# EAGLE design Apex4ROBOTS_1_0 (EAGLE 9.5.2)

## Sheet 1 of 3
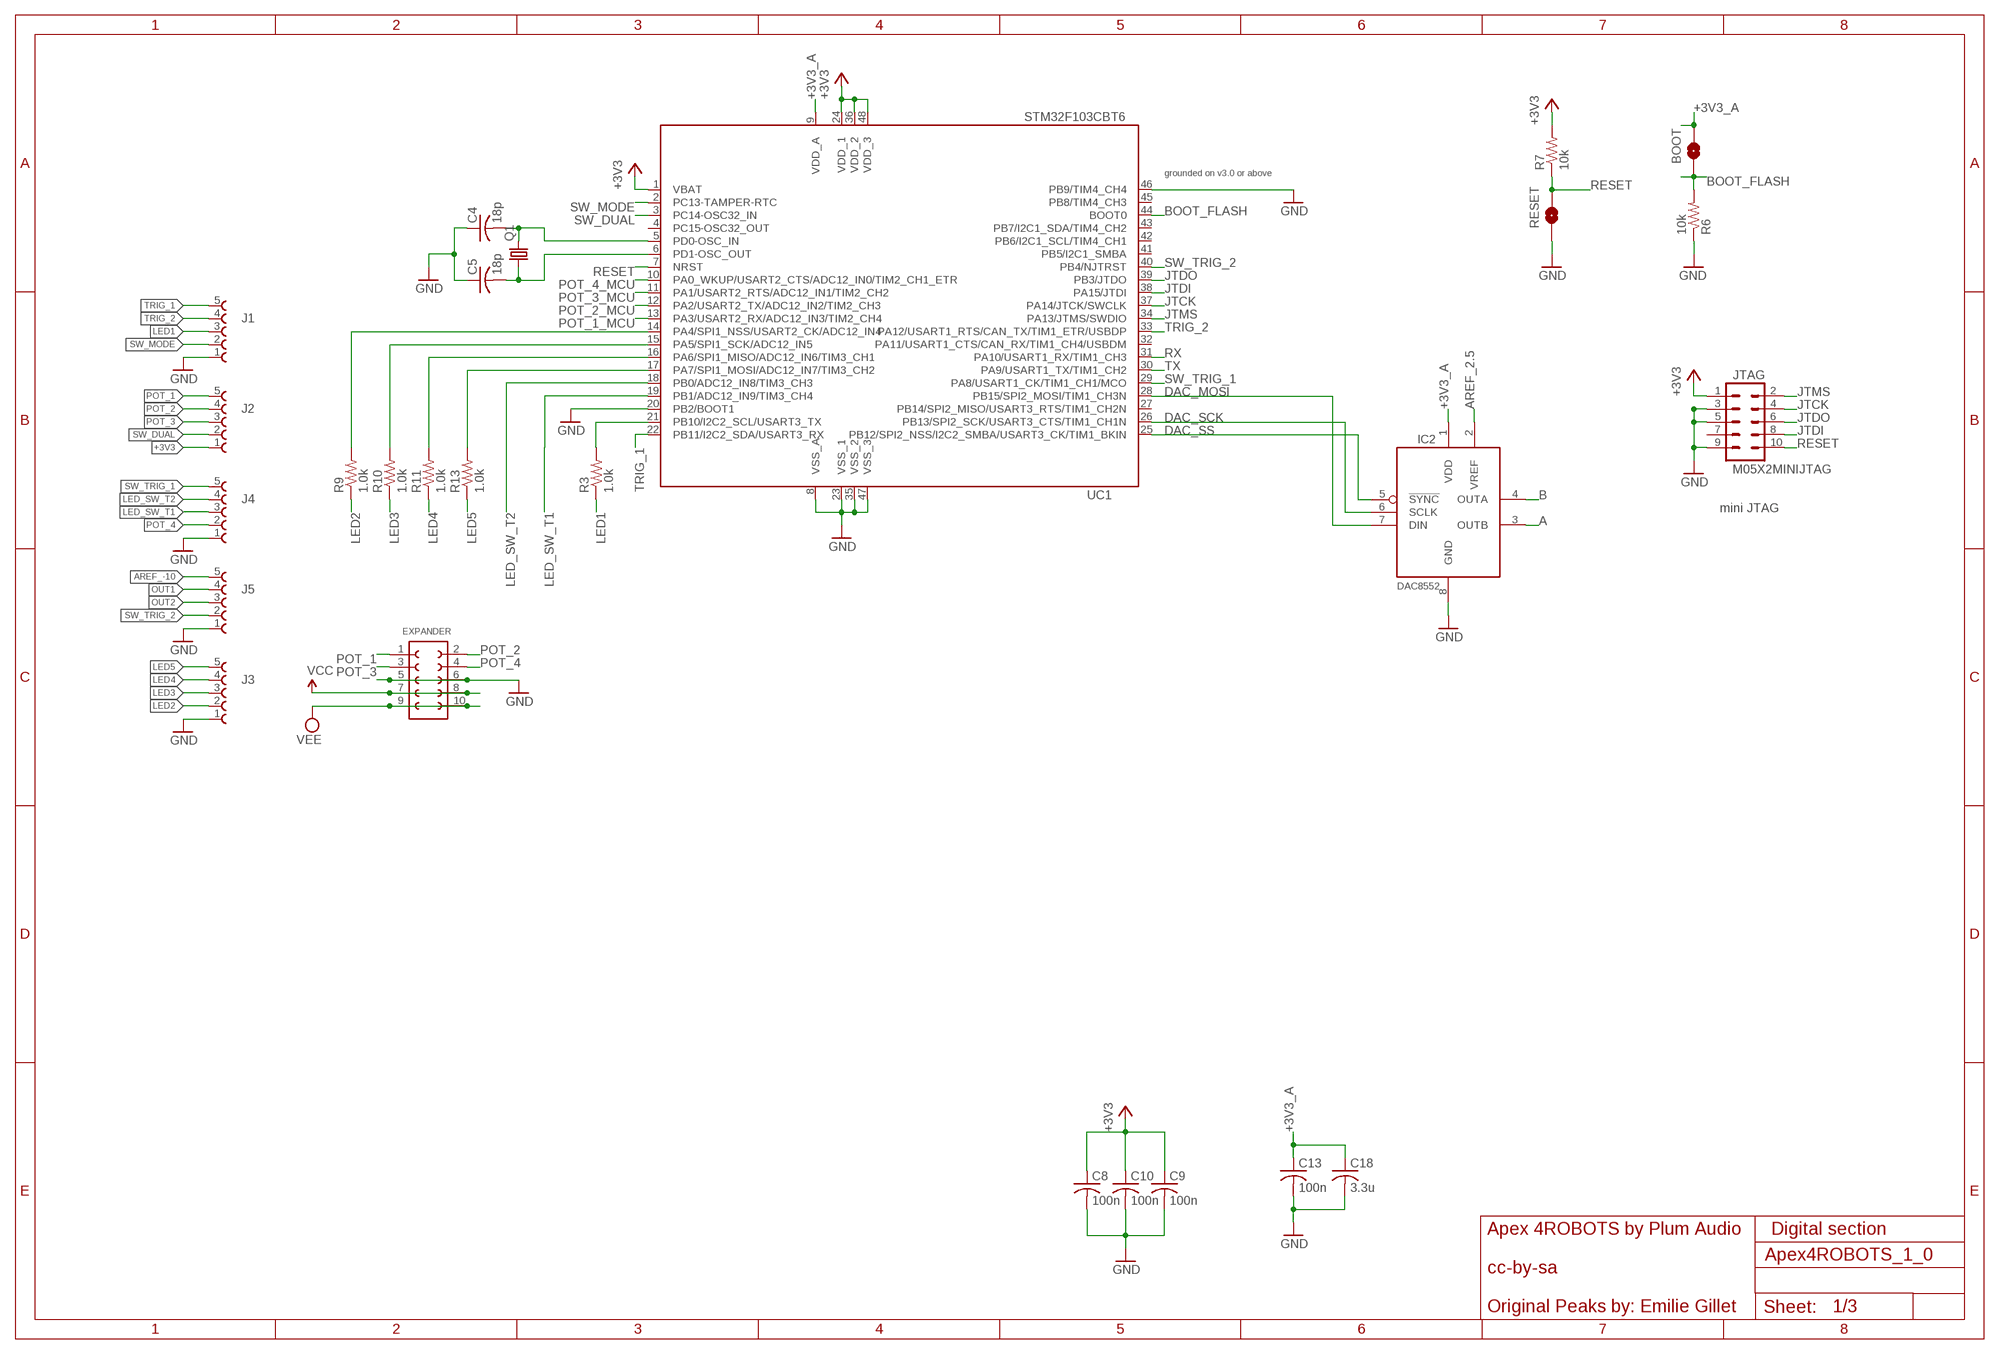
[diagram p0: schematic, sheet 1]

### Parts
BOOT  BOOT  JUMPER-SMT_2_NO_SILK  [SMT-JUMPER_2_NO_SILK]
C4  18p  C-USC0603  [C0603]
C5  18p  C-USC0603  [C0603]
C8  100n  C-USC0603  [C0603]
C9  100n  C-USC0603  [C0603]
C10  100n  C-USC0603  [C0603]
C13  100n  C-USC0603  [C0603]
C18  3.3u  C-USC0603  [C0603]
EXPANDER  61301021121  [61301021121]
IC2  DAC8552  [MSOP-8]
J1  61300511121  [61300511121]
J2  61300511121  [61300511121]
J3  61300511121  [61300511121]
J4  61300511121  [61300511121]
J5  61300511121  [61300511121]
JTAG  M05X2MINIJTAG  [2X5-1.27]
Q1  CRYSTAL7A  [XTAL500X320X120]
R3  1.0k  R-US_R0603  [R0603]
R6  10k  R-US_R0603  [R0603]
R7  10k  R-US_R0603  [R0603]
R9  1.0k  R-US_R0603  [R0603]
R10  1.0k  R-US_R0603  [R0603]
R11  1.0k  R-US_R0603  [R0603]
R13  1.0k  R-US_R0603  [R0603]
RESET  RESET  JUMPER-SMT_2_NO_SILK  [SMT-JUMPER_2_NO_SILK]
UC1  STM32F103CBT6  STM32F103CB  [LQFP48]

### Nets
+3V3: C8.1 C9.1 C10.1 J2.1 JTAG.1 R7.2 UC1.1(VBAT) UC1.24(VDD_1) UC1.36(VDD_2) UC1.48(VDD_3) ; also sheet 3
+3V3_A: BOOT.2 C13.1 C18.1 IC2.1(VDD) UC1.9(VDD_A) ; also sheet 2,3
A: IC2.3(OUTB) ; also sheet 2
AREF_2.5: IC2.2(VREF) ; also sheet 3
AREF_-10: J5.5 ; also sheet 2,3
B: IC2.4(OUTA) ; also sheet 2
BOOT_FLASH: BOOT.1 R6.2 UC1.44(BOOT0)
DAC_MOSI: IC2.7(DIN) UC1.28(PB15/SPI2_MOSI/TIM1_CH3N)
DAC_SCK: IC2.6(SCLK) UC1.26(PB13/SPI2_SCK/USART3_CTS/TIM1_CH1N)
DAC_SS: IC2.5(!SYNC) UC1.25(PB12/SPI2_NSS/I2C2_SMBA/USART3_CK/TIM1_BKIN)
GND: C4.1 C5.1 C8.2 C9.2 C10.2 C13.2 C18.2 EXPANDER.5 EXPANDER.6 IC2.8(GND) J1.1 J3.1 J4.1 J5.1 JTAG.3 JTAG.5 JTAG.9 R6.1 RESET.1 UC1.8(VSS_A) UC1.20(PB2/BOOT1) UC1.23(VSS_1) UC1.35(VSS_2) UC1.46(PB9/TIM4_CH4) UC1.47(VSS_3) ; also sheet 2,3
JTCK: JTAG.4 UC1.37(PA14/JTCK/SWCLK)
JTDI: JTAG.8 UC1.38(PA15/JTDI)
JTDO: JTAG.6 UC1.39(PB3/JTDO)
JTMS: JTAG.2 UC1.34(PA13/JTMS/SWDIO)
LED1: J1.3 R3.1
LED2: J3.2 R9.1
LED3: J3.3 R10.1
LED4: J3.4 R11.1
LED5: J3.5 R13.1
LED_SW_T1: J4.3 UC1.19(PB1/ADC12_IN9/TIM3_CH4)
LED_SW_T2: J4.4 UC1.18(PB0/ADC12_IN8/TIM3_CH3)
N$7: C4.2 Q1.2 UC1.5(PD0-OSC_IN)
N$8: C5.2 Q1.1 UC1.6(PD1-OSC_OUT)
N$10: R9.2 UC1.14(PA4/SPI1_NSS/USART2_CK/ADC12_IN4)
N$11: R10.2 UC1.15(PA5/SPI1_SCK/ADC12_IN5)
N$12: R11.2 UC1.16(PA6/SPI1_MISO/ADC12_IN6/TIM3_CH1)
N$13: R13.2 UC1.17(PA7/SPI1_MOSI/ADC12_IN7/TIM3_CH2)
N$19: R3.2 UC1.21(PB10/I2C2_SCL/USART3_TX)
OUT1: J5.4 ; also sheet 2
OUT2: J5.3 ; also sheet 2
POT_1: EXPANDER.1 J2.5 ; also sheet 2
POT_1_MCU: UC1.13(PA3/USART2_RX/ADC12_IN3/TIM2_CH4) ; also sheet 2
POT_2: EXPANDER.2 J2.4 ; also sheet 2
POT_2_MCU: UC1.12(PA2/USART2_TX/ADC12_IN2/TIM2_CH3) ; also sheet 2
POT_3: EXPANDER.3 J2.3 ; also sheet 2
POT_3_MCU: UC1.11(PA1/USART2_RTS/ADC12_IN1/TIM2_CH2) ; also sheet 2
POT_4: EXPANDER.4 J4.2 ; also sheet 2
POT_4_MCU: UC1.10(PA0_WKUP/USART2_CTS/ADC12_IN0/TIM2_CH1_ETR) ; also sheet 2
RESET: JTAG.10 R7.1 RESET.2 UC1.7(NRST)
RX: UC1.31(PA10/USART1_RX/TIM1_CH3)
SW_DUAL: J2.2 UC1.3(PC14-OSC32_IN)
SW_MODE: J1.2 UC1.2(PC13-TAMPER-RTC)
SW_TRIG_1: J4.5 UC1.29(PA8/USART1_CK/TIM1_CH1/MCO)
SW_TRIG_2: J5.2 UC1.40(PB4/NJTRST)
TRIG_1: J1.5 UC1.22(PB11/I2C2_SDA/USART3_RX)
TRIG_2: J1.4 UC1.33(PA12/USART1_RTS/CAN_TX/TIM1_ETR/USBDP)
TX: UC1.30(PA9/USART1_TX/TIM1_CH2)
VCC: EXPANDER.7 EXPANDER.8 ; also sheet 2,3
VEE: EXPANDER.9 EXPANDER.10 ; also sheet 2,3
Unconnected: JTAG.7 UC1.4(PC15-OSC32_OUT) UC1.27(PB14/SPI2_MISO/USART3_RTS/TIM1_CH2N) UC1.32(PA11/USART1_CTS/CAN_RX/TIM1_CH4/USBDM) UC1.41(PB5/I2C1_SMBA) UC1.42(PB6/I2C1_SCL/TIM4_CH1) UC1.43(PB7/I2C1_SDA/TIM4_CH2) UC1.45(PB8/TIM4_CH3)

### Notes on the sheet
- grounded on v3.0 or above
- mini JTAG
- Apex 4ROBOTS by Plum Audio | Digital section
- cc-by-sa
- Original Peaks by: Emilie Gillet

## Sheet 2 of 3
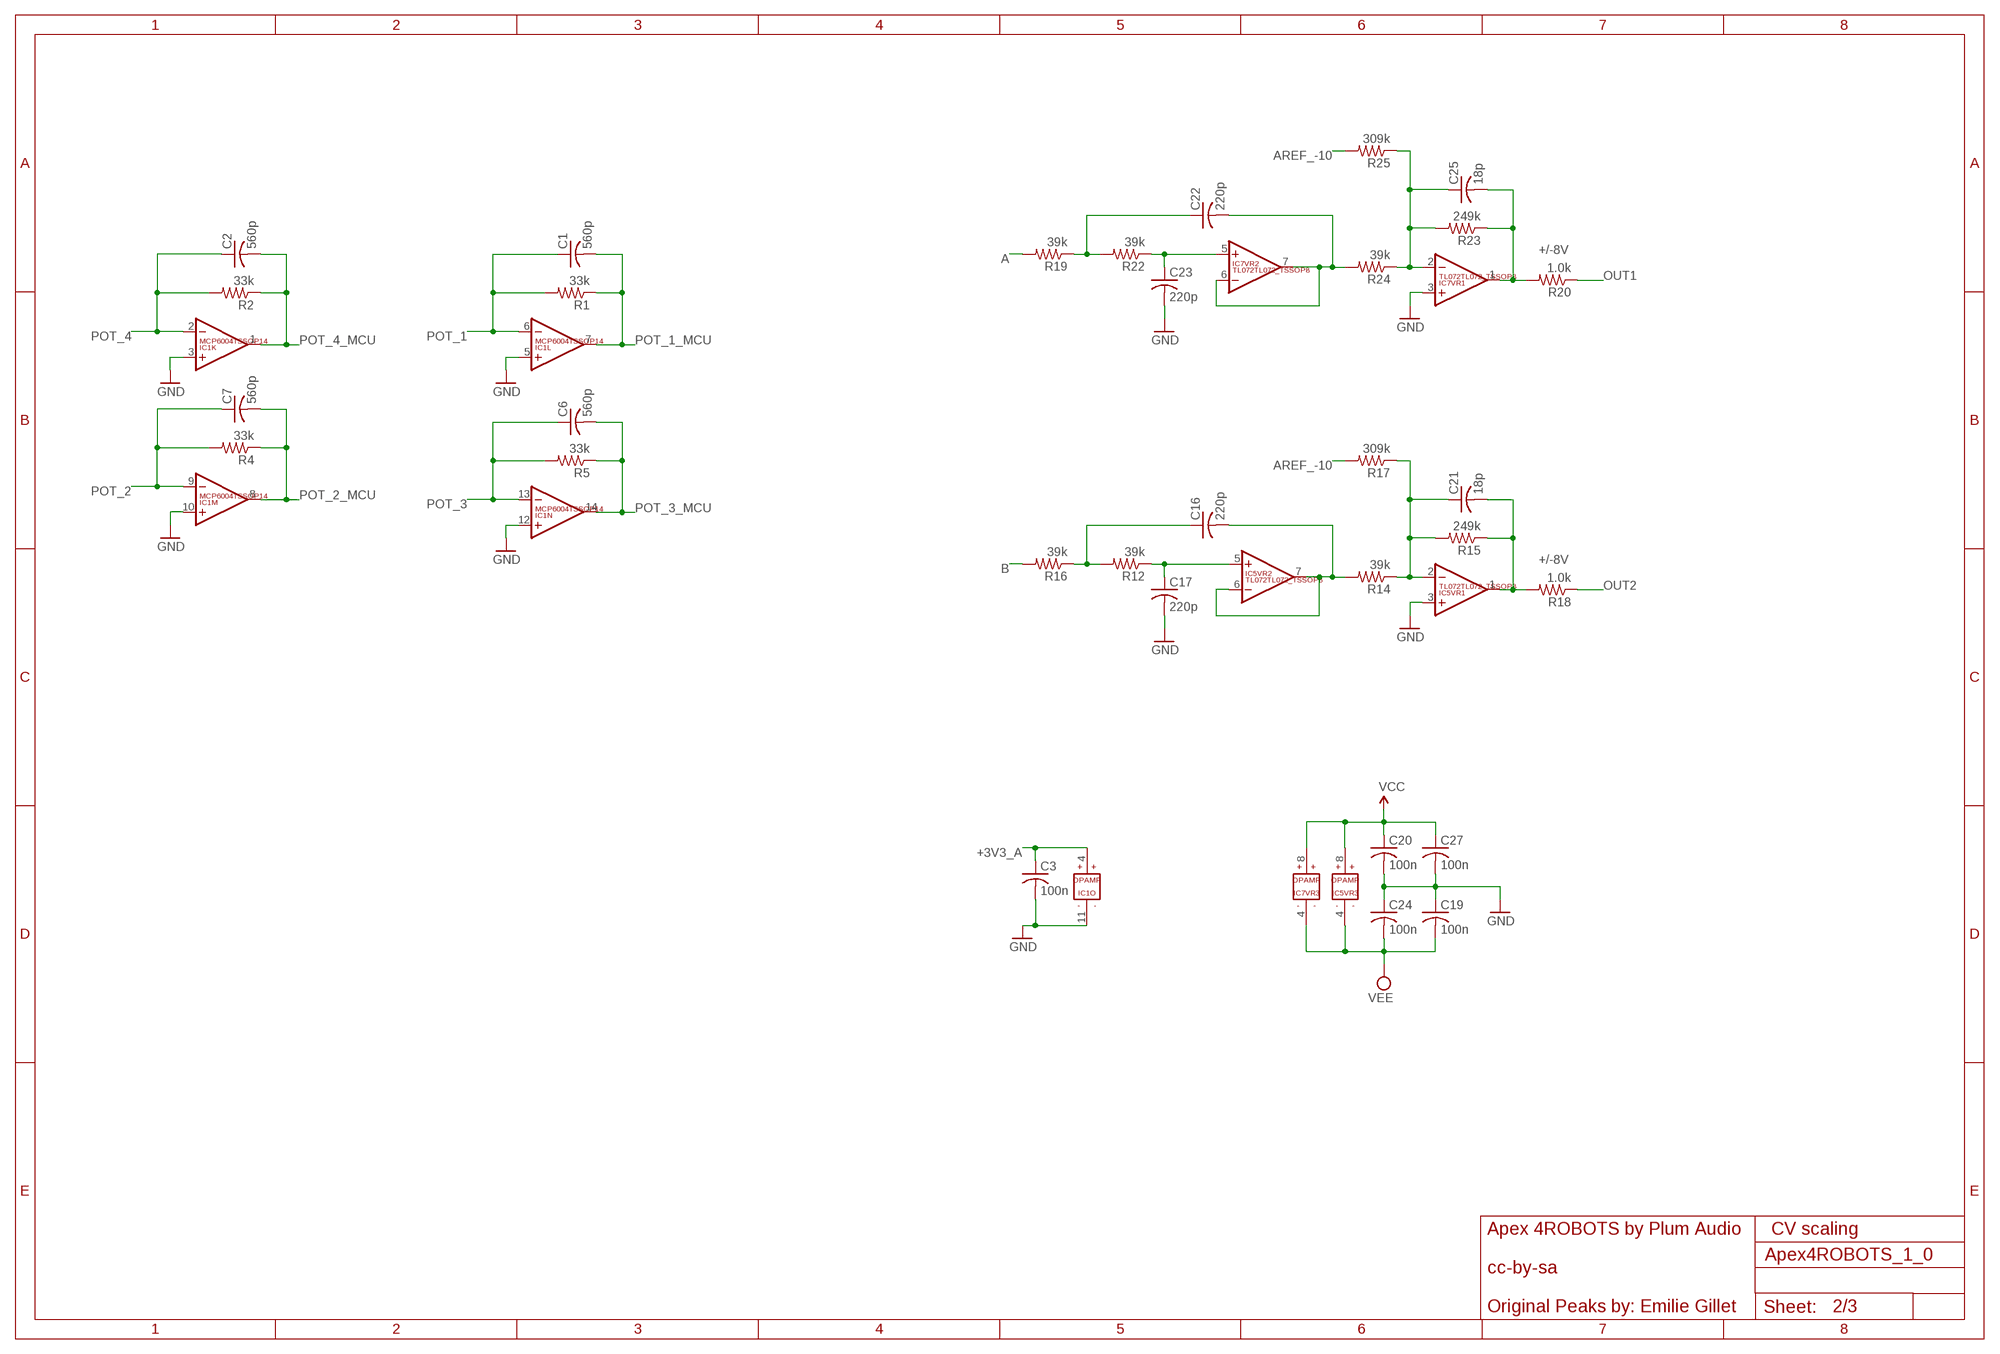
[diagram p1: schematic, sheet 2]

### Parts
C1  560p  C-USC0603  [C0603]
C2  560p  C-USC0603  [C0603]
C3  100n  C-USC0603  [C0603]
C6  560p  C-USC0603  [C0603]
C7  560p  C-USC0603  [C0603]
C16  220p  C-USC0603  [C0603]
C17  220p  C-USC0603  [C0603]
C19  100n  C-USC0603  [C0603]
C20  100n  C-USC0603  [C0603]
C21  18p  C-USC0603  [C0603]
C22  220p  C-USC0603  [C0603]
C23  220p  C-USC0603  [C0603]
C24  100n  C-USC0603  [C0603]
C25  18p  C-USC0603  [C0603]
C27  100n  C-USC0603  [C0603]
IC1  MCP6004TSSOP14  [TSSOP14]
IC5  TL072TL072_TSSOP8  [TL072_TSSOP8]
IC7  TL072TL072_TSSOP8  [TL072_TSSOP8]
R1  33k  R-US_R0603  [R0603]
R2  33k  R-US_R0603  [R0603]
R4  33k  R-US_R0603  [R0603]
R5  33k  R-US_R0603  [R0603]
R12  39k  R-US_R0603  [R0603]
R14  39k  R-US_R0603  [R0603]
R15  249k  R-US_R0603  [R0603]
R16  39k  R-US_R0603  [R0603]
R17  309k  R-US_R0603  [R0603]
R18  1.0k  R-US_R0603  [R0603]
R19  39k  R-US_R0603  [R0603]
R20  1.0k  R-US_R0603  [R0603]
R22  39k  R-US_R0603  [R0603]
R23  249k  R-US_R0603  [R0603]
R24  39k  R-US_R0603  [R0603]
R25  309k  R-US_R0603  [R0603]

### Nets
+3V3_A: C3.1 IC1.4(O:V+) ; also sheet 1,3
A: R19.2 ; also sheet 1
AREF_-10: R17.2 R25.2 ; also sheet 1,3
B: R16.2 ; also sheet 1
BI_OUT: C21.2 IC5.1(VR1:OUT) R15.1 R18.2
BI_OUT1: C25.2 IC7.1(VR1:OUT) R20.2 R23.1
F_CV: C21.1 IC5.2(VR1:-IN) R14.1 R15.2 R17.1
F_CV1: C25.1 IC7.2(VR1:-IN) R23.2 R24.1 R25.1
GND: C3.2 C17.2 C19.1 C20.2 C23.2 C24.1 C27.2 IC1.3(K:+IN) IC1.5(L:+IN) IC1.10(M:+IN) IC1.11(O:V-) IC1.12(N:+IN) IC5.3(VR1:+IN) IC7.3(VR1:+IN) ; also sheet 1,3
N$15: C22.2 IC7.6(VR2:-IN) IC7.7(VR2:OUT) R24.2
N$20: C23.1 IC7.5(VR2:+IN) R22.1
N$21: C22.1 R19.1 R22.2
N$42: C16.2 IC5.6(VR2:-IN) IC5.7(VR2:OUT) R14.2
N$43: C17.1 IC5.5(VR2:+IN) R12.1
N$45: C16.1 R12.2 R16.1
OUT1: R20.1 ; also sheet 1
OUT2: R18.1 ; also sheet 1
POT_1: C1.1 IC1.6(L:-IN) R1.2 ; also sheet 1
POT_1_MCU: C1.2 IC1.7(L:OUT) R1.1 ; also sheet 1
POT_2: C7.1 IC1.9(M:-IN) R4.2 ; also sheet 1
POT_2_MCU: C7.2 IC1.8(M:OUT) R4.1 ; also sheet 1
POT_3: C6.1 IC1.13(N:-IN) R5.2 ; also sheet 1
POT_3_MCU: C6.2 IC1.14(N:OUT) R5.1 ; also sheet 1
POT_4: C2.1 IC1.2(K:-IN) R2.2 ; also sheet 1
POT_4_MCU: C2.2 IC1.1(K:OUT) R2.1 ; also sheet 1
VCC: C20.1 C27.1 IC5.8(VR3:V+) IC7.8(VR3:V+) ; also sheet 1,3
VEE: C19.2 C24.2 IC5.4(VR3:V-) IC7.4(VR3:V-) ; also sheet 1,3

### Notes on the sheet
- +/-8V
- +/-8V
- Apex 4ROBOTS by Plum Audio | CV scaling
- cc-by-sa
- Original Peaks by: Emilie Gillet

## Sheet 3 of 3
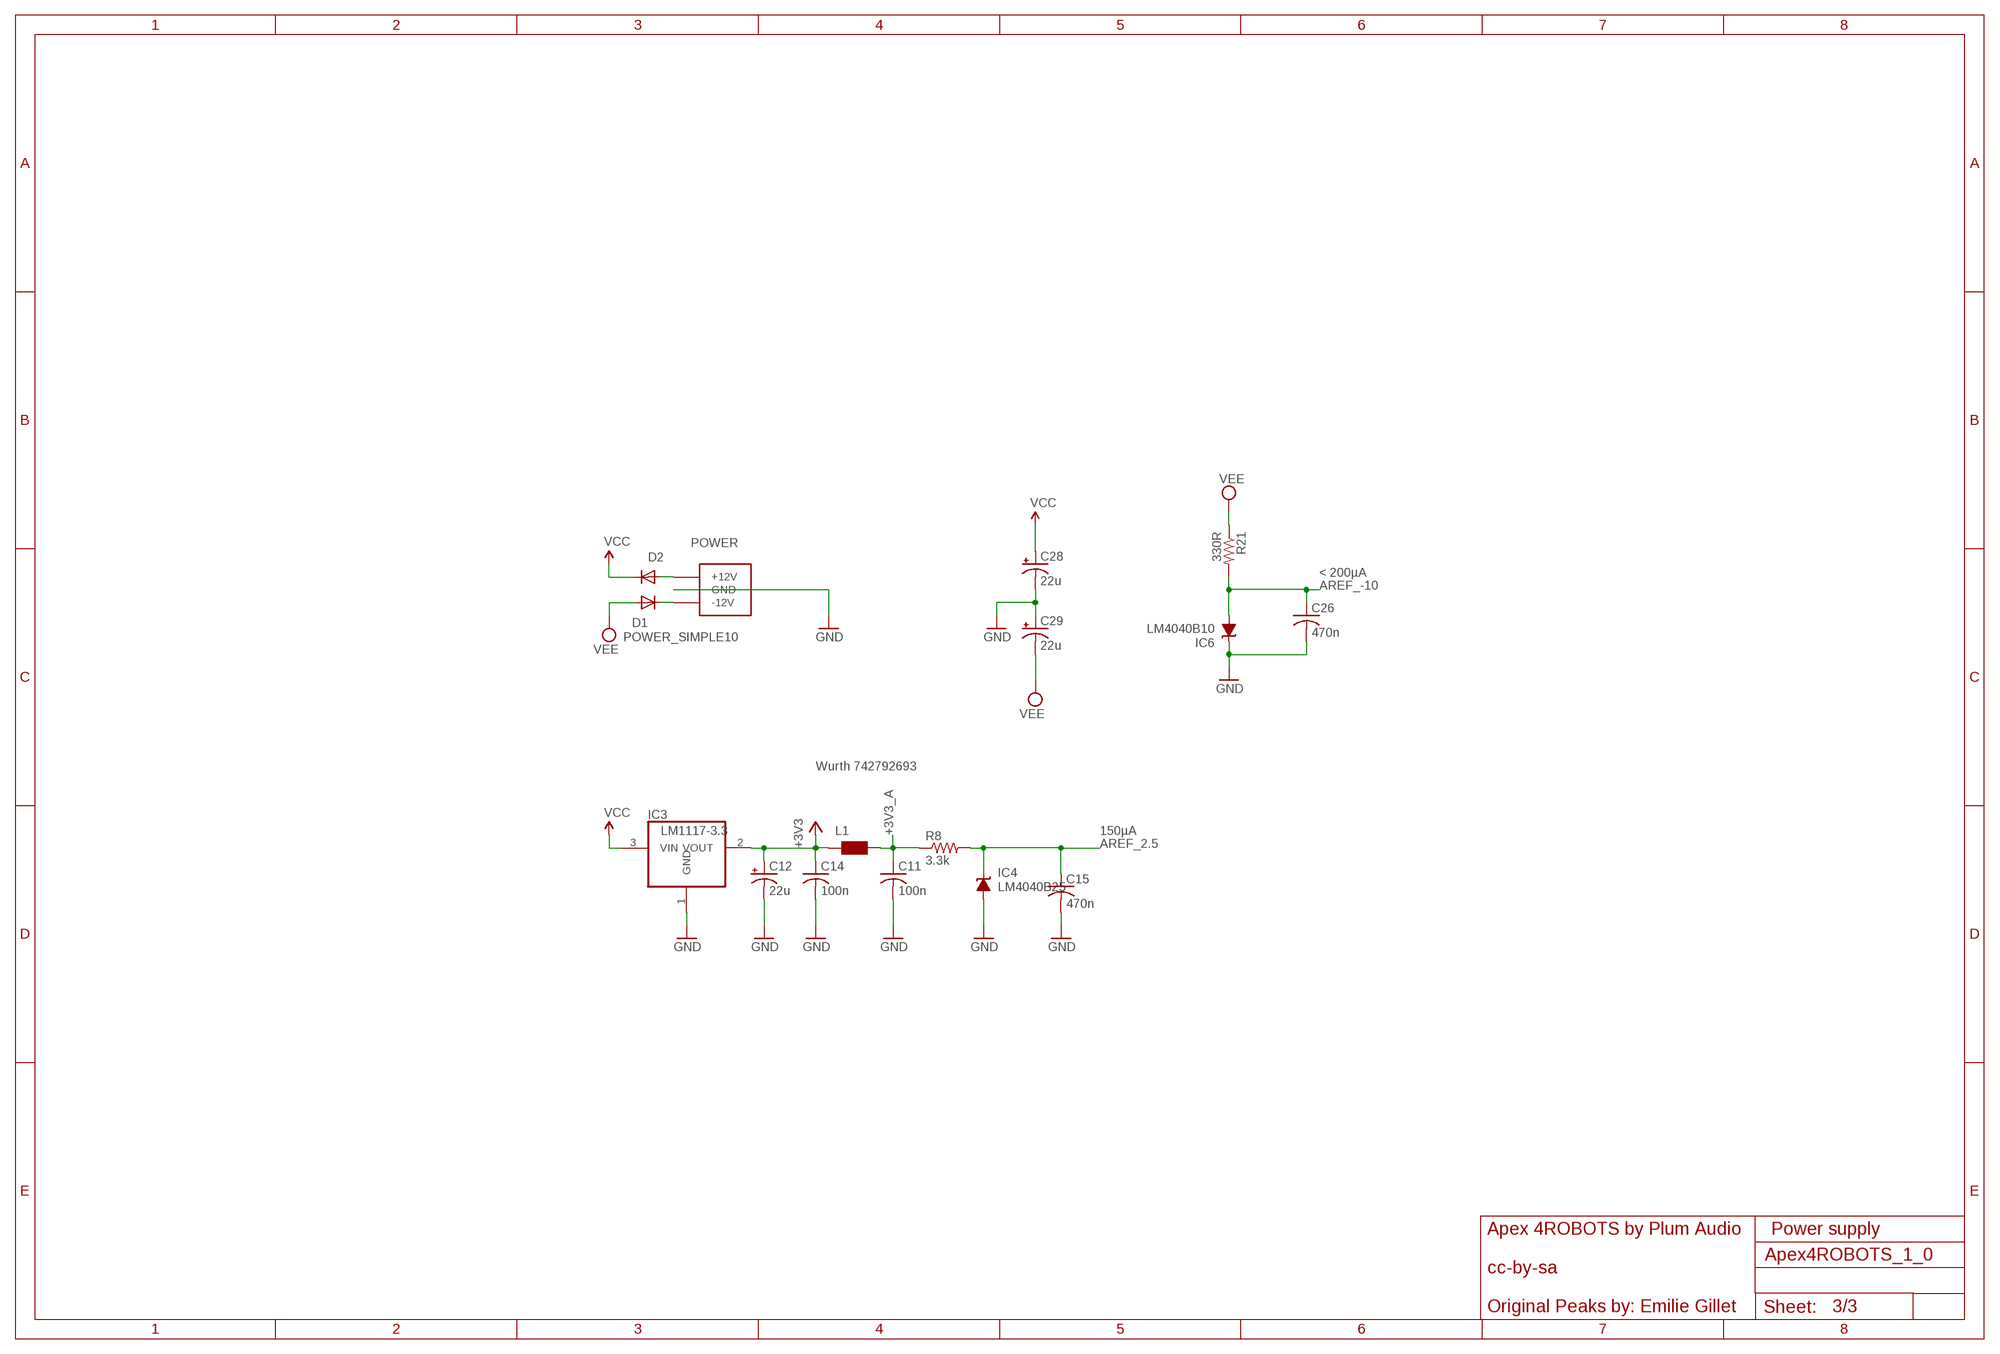
[diagram p2: schematic, sheet 3]

### Parts
C11  100n  C-USC0603  [C0603]
C12  22u  CPOL-USC  [PANASONIC_C]
C14  100n  C-USC0603  [C0603]
C15  470n  C-USC0603  [C0603]
C26  470n  C-USC0603  [C0603]
C28  22u  CPOL-USC  [PANASONIC_C]
C29  22u  CPOL-USC  [PANASONIC_C]
D1  1N5819HW  DIODE-SOD123  [SOD123]
D2  1N5819HW  DIODE-SOD123  [SOD123]
IC3  LM1117-3.3  REG1117  [SOT223]
IC4  LM4040B25  LM4041B12DBZ  [DBZ_R-PDSO-G3]
IC6  LM4040B10  LM4041B12DBZ  [DBZ_R-PDSO-G3]
L1  WE-CBF_0603  [0603]
POWER  POWER_SIMPLE10  [POWER_10]
R8  3.3k  R-US_R0603  [R0603]
R21  330R  R-US_R0603  [R0603]

### Nets
+3V3: C12.+ C14.1 IC3.2(VOUT) L1.1 ; also sheet 1
+3V3_A: C11.1 L1.2 R8.1 ; also sheet 1,2
AREF_2.5: C15.1 IC4.1(C) R8.2 ; also sheet 1
AREF_-10: C26.1 IC6.2(A) R21.2 ; also sheet 1,2
GND: C11.2 C12.- C14.2 C15.2 C26.2 C28.- C29.+ IC3.1(GND) IC4.2(A) IC6.1(C) POWER.3(GND) POWER.4(GND) POWER.5(GND) POWER.6(GND) POWER.7(GND) POWER.8(GND) ; also sheet 1,2
N$23: D2.A POWER.9(+12V) POWER.10(+12V)
N$25: D1.C POWER.1(-12V) POWER.2(-12V)
VCC: C28.+ D2.C IC3.3(VIN) ; also sheet 1,2
VEE: C29.- D1.A R21.1 ; also sheet 1,2

### Notes on the sheet
- < 200µA
- Wurth 742792693
- 150µA
- Apex 4ROBOTS by Plum Audio | Power supply
- cc-by-sa
- Original Peaks by: Emilie Gillet

## Library data of the parts
BOOT RESET = SparkFun-Jumpers:JUMPER-SMT_2_NO: Normally open jumper This jumper has two pads in close proximity to each other. Apply solder to close the connection. Round pads are easier to solder for beginners, but are a lot larger. SparkFun Product that uses the round pads: SparkFun EL Sequencer <https://www.sparkfun.com/products/12781>
C1-C11 C13-C27 = rcl:C-US: CAPACITOR, American symbol
C12 C28 C29 = rcl:CPOL-US: POLARIZED CAPACITOR, American symbol
D1 D2 = diode:DIODE-: DIODE
EXPANDER = Wurth_Elektronik_Electromechanic_Board_to_Board_Connectors_rev18b:61301021121: WR-PHD 2.54mm Dual Pin Header, 10 Pins =>Code : Con_BTB_PHD_2.54_2_61301021121 <http://katalog.we-online.de/media/images/eican/Con_BTB_PHD_2.54_2_6130xx21121_pf2.jpg> Details see: http://katalog.we-online.de/en/em/613_0xx_211_21 Created 2014-05-29, Karrer Zheng 2014 (C) Würth Elektronik
IC1 = EurorackModularParts:MCP6004
IC2 = og-dac:DAC8552
IC3 = og-vreg:REG1117: 800mA and 1A Low Dropout (LDO) Positive Regulator 1.8V, 2.5V, 2.85V, 3.3V, 5V, and Adj
IC4 IC6 = texas:LM4041: PRECISION MICROPOWER SHUNT VOLTAGE REFERENCE Source: http://focus.ti.com/lit/ds/slcs146e/slcs146e.pdf
IC5 IC7 = EurorackModularParts:TL072
J1-J5 = Wurth_Elektronik_Electromechanic_Board_to_Board_Connectors_rev17a:61300511121: WR-PHD 2.54mm Pin Header, 5 Pin =>Code : Con_BTB_PHD_2.54_1_THT_61300511121 <http://katalog.we-online.de/media/images/eican/Con_BTB_PHD_2.54_1_THT_6130xx11121_pf2.jpg> Details see: http://katalog.we-online.de/en/em/613_0xx_111_21 Created 2014-05-29, Karrer Zheng 2014 (C) Würth Elektronik
JTAG = og-header:M05X2: Header 5x2 Standard 10-pin dual row 0.1" header. Commonly used with AVR-ISP. Use with Spark Fun Electronics SKU: PRT-00778
L1 = wuerth-elektronik:WE-CBF: SMD EMI Suppression Ferrite Beads - excellent anti-EMI properties - low DCR - impedances till 3000 ohms - rated current up to 6 A
POWER = EurorackModularParts:POWER_SIMPLE
Q1 = crystal:CRYSTAL: CRYSTAL
R1-R25 = rcl:R-US_: RESISTOR, American symbol
UC1 = stm32:STM32F103CB

## Board
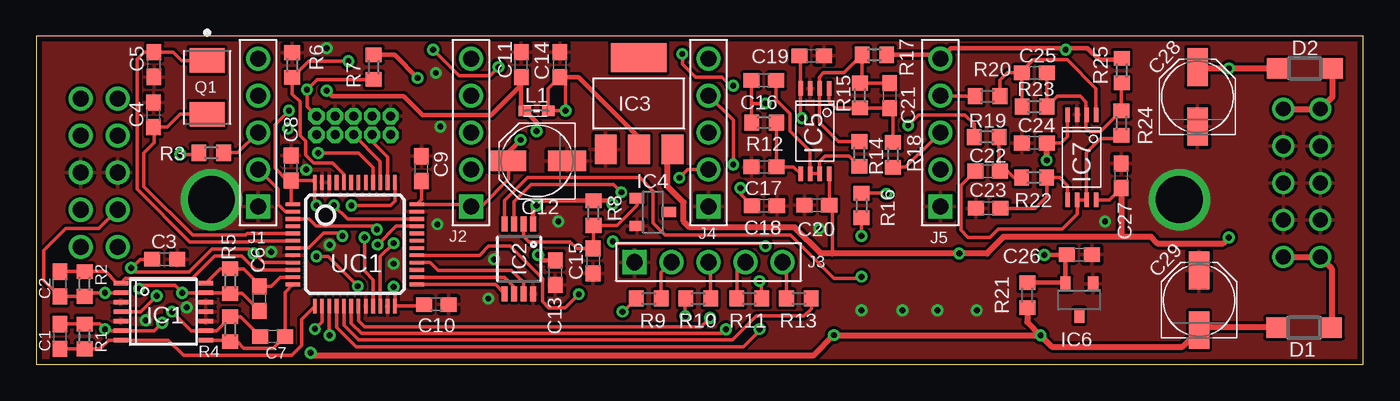
[diagram p3: board, top side]
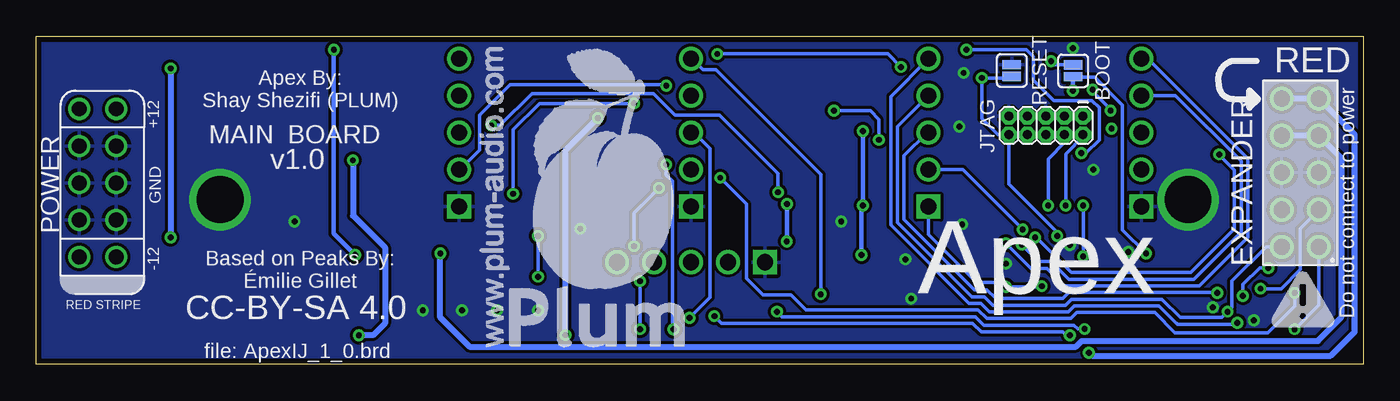
[diagram p4: board, bottom side, seen from below]

Size 91 x 22.5 mm. Coordinates in mm from the lower left corner, seen from the top.
Outline: 0,0 91,0 91,22.5 0,22.5 0,0
Copper layers (1*16): Top 0.035mm / dielectric 1.5mm / Bottom 0.035mm
Design rules "default *": minimum track width 8mil, minimum drill 0.4mm, track to track 8mil, track to pad 6mil, pad to pad 6mil, via to via 6mil, smd to smd 6mil, copper to edge 15mil, drill to drill 6mil, minimum pad ring 10mil, minimum via ring 8mil, stop-mask expansion 4mil, vias tented up to drill 20mil, thermal gap 10mil

### Footprints (pad centres in the part's own frame; a part is rotated, then mirrored left to right if it is on the bottom)
SMT-JUMPER_2_NO_SILK = smd 0.635 x 1.27: 1 -0.406,0; 2 0.406,0
C0603 = smd 1.1 x 1: 1 -0.85,0; 2 0.85,0
PANASONIC_C = smd 2.6 x 1.4: + 2.05,0; - -2.05,0
SOD123 = smd 1.4 x 1.4: A 1.9,0; C -1.9,0
61301021121 = drill 1.1: 1 -5.08,-1.27; 2 -5.08,1.27; 3 -2.54,-1.27; 4 -2.54,1.27; 5 0,-1.27; 6 0,1.27; 7 2.54,-1.27; 8 2.54,1.27; 9 5.08,-1.27; 10 5.08,1.27
TSSOP14 = smd 0.305 x 0.991: 1 -1.95,-2.918; 2 -1.3,-2.918; 3 -0.65,-2.918; 4 0,-2.918; 5 0.65,-2.918; 6 1.3,-2.918; 7 1.95,-2.918; 8 1.95,2.918; 9 1.3,2.918; 10 0.65,2.918; 11 0,2.918; 12 -0.65,2.918; 13 -1.3,2.918; 14 -1.95,2.918
MSOP-8 = smd 0.41 x 1.02: 1 -0.975,-2.4; 2 -0.325,-2.4; 3 0.325,-2.4; 4 0.975,-2.4; 5 0.975,2.4; 6 0.325,2.4; 7 -0.325,2.4; 8 -0.975,2.4
SOT223 = smd 1.499 x 2.007: 1 -2.261,-3.15; 2 0.025,-3.15; 3 2.311,-3.15 | smd 3.81 x 2.007: 4 0,3.15
DBZ_R-PDSO-G3 = smd 0.7 x 1: 1 -0.95,-1.1; 2 0.95,-1.1; 3 0,1.1
TL072_TSSOP8 = smd 0.305 x 0.991: 1 -0.975,-2.918; 2 -0.325,-2.918; 3 0.325,-2.918; 4 0.975,-2.918; 5 0.975,2.918; 6 0.325,2.918; 7 -0.325,2.918; 8 -0.975,2.918
61300511121 = drill 1.1 square: 1 -5.08,0 | drill 1.1: 2 -2.54,0; 3 0,0; 4 2.54,0; 5 5.08,0
2X5-1.27 = drill 0.61 pad 1.067 octagon: 1 -1.27,3.81; 2 0,3.81; 3 -1.27,2.54; 4 0,2.54; 5 -1.27,1.27; 6 0,1.27; 7 -1.27,0; 8 0,0; 9 -1.27,-1.27; 10 0,-1.27
0603 = smd 0.85 x 0.7: 1 -0.9,0; 2 0.7,0
POWER_10 = drill 1.016: 1 -5.08,-1.27; 2 -5.08,1.27; 3 -2.54,-1.27; 4 -2.54,1.27; 5 0,-1.27; 6 0,1.27; 7 2.54,-1.27; 8 2.54,1.27; 9 5.08,-1.27; 10 5.08,1.27
XTAL500X320X120 = smd 1.7 x 2.4: 1 -1.85,0; 2 1.85,0
R0603 = smd 1 x 1.1: 1 -0.85,0; 2 0.85,0
LQFP48 = smd 0.254 x 1: 1 -2.75,-4.25; 2 -2.25,-4.25; 3 -1.75,-4.25; 4 -1.25,-4.25; 5 -0.75,-4.25; 6 -0.25,-4.25; 7 0.25,-4.25; 8 0.75,-4.25; 9 1.25,-4.25; 10 1.75,-4.25; 11 2.25,-4.25; 12 2.75,-4.25; 25 2.75,4.25; 26 2.25,4.25; 27 1.75,4.25; 28 1.25,4.25; 29 0.75,4.25; 30 0.25,4.25; 31 -0.25,4.25; 32 -0.75,4.25; 33 -1.25,4.25; 34 -1.75,4.25; 35 -2.25,4.25; 36 -2.75,4.25 | smd 1 x 0.254: 13 4.25,-2.75; 14 4.25,-2.25; 15 4.25,-1.75; 16 4.25,-1.25; 17 4.25,-0.75; 18 4.25,-0.25; 19 4.25,0.25; 20 4.25,0.75; 21 4.25,1.25; 22 4.25,1.75; 23 4.25,2.25; 24 4.25,2.75; 37 -4.25,2.75; 38 -4.25,2.25; 39 -4.25,1.75; 40 -4.25,1.25; 41 -4.25,0.75; 42 -4.25,0.25; 43 -4.25,-0.25; 44 -4.25,-0.75; 45 -4.25,-1.25; 46 -4.25,-1.75; 47 -4.25,-2.25; 48 -4.25,-2.75

### Placement (x,y rotation side)
BOOT  19.89,20.14 270 bottom
C1  1.6,1.9 270 top
C2  1.6,5.5 90 top
C3  8.8,7.2 0 top
C4  8.03,17.11 270 top
C5  8.07,20.57 90 top
C6  15.3,4.5 90 top
C7  16.2,1.9 0 top
C8  17.47,13.46 90 top
C9  26.41,13.42 90 top
C10  27.43,4.1 0 top
C11  33.25,20.56 90 top
C12  34.35,13.95 180 top
C13  35.59,6.28 270 top
C14  35.91,20.56 90 top
C15  38.18,7.08 270 top
C16  49.89,19.47 0 top
C17  49.91,13.54 180 top
C18  49.93,10.87 0 top
C19  53.18,21.17 180 top
C20  53.53,10.92 180 top
C21  58.53,18.43 270 top
C22  65.25,13.26 180 top
C23  65.28,10.7 180 top
C24  68.45,15.18 0 top
C25  68.46,19.99 180 top
C26  71.54,7.52 0 top
C27  74.41,12.93 90 top
C28  79.64,18.35 90 top
C29  79.75,4.39 90 top
D1  86.95,2.51 180 top
D2  87.01,20.3 0 top
EXPANDER  4.3,13.14 90 bottom
IC1  8.7,3.6 270 top
IC2  33.1,7.23 180 top
IC3  41.31,17.89 0 top
IC4  42.28,10.44 270 top
IC5  53.4,16 180 top
IC6  71.53,4.42 180 top
IC7  71.7,14.2 180 top
J1  15.2,15.9 90 top
J2  29.8,15.9 90 top
J3  46.1,7 0 top
J4  46.1,15.9 90 top
J5  62,15.9 90 top
JTAG  23.02,15.75 270 bottom
L1  34.21,17.39 180 top
POWER  86.79,12.44 90 bottom
Q1  11.7,19 270 top
R1  3.3,1.9 90 top
R2  3.3,5.5 270 top
R3  11.99,14.51 180 top
R4  13.3,2.4 90 top
R5  13.3,5.7 270 top
R6  17.55,20.53 270 top
R7  23.13,20.39 270 top
R8  38.21,10.37 270 top
R9  42,4.5 180 top
R10  45.4,4.5 180 top
R11  48.9,4.5 0 top
R12  49.91,16.58 180 top
R13  52.3,4.5 0 top
R14  56.45,14.43 270 top
R15  56.48,18.44 90 top
R16  56.6,10.89 270 top
R17  57.48,21.23 0 top
R18  58.75,14.37 90 top
R19  65.18,15.6 180 top
R20  65.24,18.39 0 top
R21  67.96,4.74 90 top
R22  68.44,12.81 180 top
R23  68.46,17.67 0 top
R24  74.42,16.55 270 top
R25  74.44,20.15 90 top
RESET  24.1,20.16 270 bottom
UC1  21.84,8.22 270 top

### Tracks (layer width: path | path; a pad name or v marks a point on that pad's centre or on a via)
+3V3  (via drill 0.4)
  Top 0.254: C9.1 26.41,11.29 UC1.36 29.65,10.97 J2.1 30.52,10.82 32.4,12.7 32.4,13.85 C12.+ | UC1.1 17.47,11.09 C8.1 | C8.1 18.95,12.61 UC1.48 19.09,11.01 v19.2,10.9 | 19,17.23 JTAG.1 18.55,17.68 v18.55,18.85 19.25,19.54 R7.2 | C8.1 17.2,12.61 16.36,13.45 16.36,16.44 v17.32,17.4 | 26.45,3.97 C10.1 26.48,4 24.59,4 | UC1.24 24.59,4 | 24.59,4 24.59,5.21 v24.5,5.3 | v22.04,5.36 20,7.4 v19.2,7.4 | C14.1 35.11,18.91 L1.1 v36.3,17.4 36.3,19.32 C14.1
  Top 0.305: IC3.2 41.34,15.56 37.19,19.71 C14.1 | C12.+ 32.3,14.5 v33.2,15.4
  Bottom 0.254: v19.2,10.9 v19.2,7.4 | v36.3,17.4 33.8,17.4 33.2,16.8 v33.2,15.4 | v18.55,18.85 18.55,18.73 17.32,17.5 v17.32,17.4 | J2.1 29.8,8.89 26.51,5.6 24.8,5.6 v24.5,5.3 22.1,5.3 v22.04,5.36
+3V3_A  (via drill 0.4)
  Top 0.254: UC1.9 15.6,6.97 14.97,7.6 v14.88,7.6 14.58,7.9 12.05,7.9 10.48,6.33 6.77,6.33 v6.5,6.6 7.1,7.2 C3.1 | v8.24,4.68 7.16,3.6 IC1.4 | v48.29,12.1 48.29,11.66 C18.1 | v39.53,8.43 39.66,8.3 49.8,8.3 v50,8.1
  Top 0.305: IC2.1 34.08,10.68 v34.3,10.9 34.62,11.22 R8.1 39.3,11.22 v39.52,11 | C13.1 34.77,7.13 v34.4,7.5 | v19.9,18.78 20.28,18.4 25.2,18.4 26.5,17.1 31.2,17.1 33.25,19.15 C11.1 33.25,17.65 L1.2 34.3,16.6 v34.3,16
  Bottom 0.254: BOOT.2 19.86,19.7 18.4,19.7 16.5,17.8 16.5,9.22 v14.88,7.6 | v6.5,6.6 7.1,6.6 8.24,5.46 v8.24,4.68 | v48.29,12.1 50,10.39 v50,8.1
  Bottom 0.305: v34.4,7.5 34.4,10.8 v34.3,10.9 v34.3,16 | v19.9,18.78 19.89,18.79 BOOT.2 | v39.53,8.43 v39.52,8.44 v39.52,11
A  (via drill 0.4)
  Top 0.254: IC2.3 32.77,11.18 33.94,12.34 39.58,12.34 v40.12,11.8 | v59.8,16.4 60.5,17.1 63.7,17.1 64.33,16.47 R19.2
  Bottom 0.254: v40.12,11.8 40.12,13.08 44.15,17.1 47.19,17.1 48.67,18.58 57,18.58 59.18,16.4 v59.8,16.4
AREF_2.5
  Top 0.254: IC4.1 41.18,10.88 39.82,9.52 R8.2 38.21,7.96 C15.1 37.07,7.93 36.6,8.4 33.8,8.4 33.42,8.78 IC2.2
AREF_-10  (via drill 0.4)
  Top 0.254: 74.34,20.9 R25.2 | IC6.2 70.58,5.6 | 70.58,7.41 C26.1 70.67,7.5 | R21.2 | v70.6,21.59 70.6,21.7
  Top 0.305: 74.34,20.9 72.9,20.9 72.1,21.7 70.6,21.7 62.72,21.7 J5.5 61.75,21.23 R17.2 | 70.58,7.41 70.58,5.6 R21.2 | 70.67,7.5 v69.14,7.5
  Bottom 0.305: v70.6,21.59 70.6,8.96 v69.14,7.5
B  (via drill 0.4)
  Top 0.254: IC2.4 32.12,11.22 33.7,12.8 41.4,12.8 42.3,11.9 42.3,9.7 43.13,8.87 51.73,8.87 54.7,5.9 56.5,5.9 v56.6,6 | v56.6,8.8 R16.2
  Bottom 0.254: v56.6,6 v56.6,8.8
BI_OUT
  Top 0.254: R18.2 58.75,17.36 C21.2 R15.1 54.81,17.59 54.38,18.02 IC5.1
BI_OUT1
  Top 0.254: R20.2 66.09,19.49 66.6,20 67.5,20 | 67.5,20 C25.2 R23.1 | IC7.1 72.67,18.93 70.7,20.9 68.4,20.9 67.5,20
BOOT_FLASH  (via drill 0.4)
  Top 0.254: R6.2 17.7,19.53 | UC1.44 21.09,13.01 20.3,13.8 19.02,13.8 18.46,14.36 18.46,15.31 18.09,15.69 18.09,18.01 17.55,18.55 R6.2 | R6.2 18.67,20.8 v21.4,20.8
  Bottom 0.254: BOOT.1 21.15,20.55 v21.4,20.8
DAC_MOSI
  Top 0.254: UC1.28 27,6.97 27.54,6.43 32.6,6.43 33.42,5.6 IC2.7
DAC_SCK
  Top 0.254: UC1.26 32.09,5.97 32.77,5.29 IC2.6
DAC_SS
  Top 0.254: UC1.25 31.48,5.47 IC2.5
F_CV
  Top 0.254: R14.1 55.02,15.28 53.73,16.57 IC5.2 53.7,18.94 53.7,19.7 54,20 55.4,20 R17.1 56.63,19.44 R15.2 C21.1
F_CV1
  Top 0.254: R25.1 74.42,19.28 R24.1 72.97,15.95 72.25,15.95 72,16.2 72,17.09 | 72,17.09 IC7.2 | C25.1 R23.2 70.04,18.4 71.6,18.4 72,18 72,17.09
GMD  (via drill 0.4)
  other vias: 17.25,16.17
GND  (via drill 0.4, 3.2)
  other vias: 16.1,7.7 53.7,9.3 56.6,3.7 59.4,3.7 61.8,3.7 64.5,3.7 31.4,7.2 19.9,21.7 27.4,20 27.7,16.3 31,4.5 20.11,8.19 12,11.3 78.4,11.3 18.5,13.35 24.5,6.9 27.5,9.6 35.8,9.8 73.3,9.8 10.3,3.9 7.5,3
  pour Top: 0,0 0,22.5 32.5,22.5 91,22.5 91,0
  pour Bottom: 0,0 0,22.5 32.5,22.5 91,22.5 91,0
JTCK  (via drill 0.4)
  Top 0.254: v21.6,10.9 24.3,10.9 24.6,11.2 UC1.37
  Bottom 0.254: JTAG.4 20.48,15.2 21.6,14.08 v21.6,10.9
JTDI
  Top 0.254: UC1.38 24.09,14.21 23.02,15.28 JTAG.8
JTDO
  Top 0.254: JTAG.6 23.59,13.91 UC1.39
JTMS  (via drill 0.4)
  Top 0.254: v20.4,10.9 21.33,9.97 UC1.34
  Bottom 0.254: JTAG.2 19.21,15.61 20.4,14.42 v20.4,10.9
LED1
  Top 0.254: R3.1 13.81,14.51 J1.3
LED2
  Top 0.254: R9.1 42.85,6.29 J3.2
LED3
  Top 0.254: J3.3 46.25,6.85 R10.1
LED4
  Top 0.254: R11.1 48.05,6.41 J3.4
LED5
  Top 0.254: J3.5 51.45,6.73 R13.1
LED_SW_T1  (via drill 0.4)
  Top 0.254: UC1.19 22.09,2.98 22.5,2.57 45.59,2.57 v46.2,3.18
  Bottom 0.254: v46.2,3.18 44.8,4.58 44.8,14.8 45.9,15.9 J4.3
LED_SW_T2  (via drill 0.4)
  Top 0.254: UC1.18 21.59,2.81 22.29,2.11 47.02,2.11 v47.3,2.39 | J4.4 47.8,16.74 v47.8,13.7
  Bottom 0.254: 47.4,2.5 v47.3,2.39 47.37,2.46 47.37,12.57 47.8,13 v47.8,13.7
N$7
  Top 0.254: UC1.5 14.7,8.97 | 14.7,8.97 14.45,8.97 14.34,8.86 10.7,8.86 7.36,12.2 7.36,14.48 8.07,15.2 8.07,16.16 8.1,16.19 C4.2 8.96,16.26 9.85,17.15 Q1.2 | 14.7,8.97
N$8
  Top 0.254: UC1.6 14.6,8.47 14.53,8.4 10.51,8.4 6.9,12.01 6.9,20.92 7.4,21.42 C5.2 9.38,21.42 9.95,20.85 Q1.1
N$10  (via drill 0.4)
  Top 0.254: R9.2 40.25,3.6 v40.2,3.6 | UC1.14 19.59,2.9 v19.1,2.41
  Bottom 0.254: v40.2,3.6 39.86,3.26 26.59,3.26 26,2.67 19.84,2.67 19.83,2.67 19.57,2.41 v19.1,2.41
N$11  (via drill 0.4)
  Top 0.254: R10.2 44.5,4.45 v44.5,3.3 | UC1.15 20.09,2 v20.11,1.98
  Bottom 0.254: v44.5,3.3 44,2.8 26.78,2.8 26.19,2.21 20.6,2.21 20.37,1.98 v20.11,1.98
N$12  (via drill 0.4)
  Top 0.254: UC1.16 20.59,2.52 21.91,1.2 48.5,1.2 49.6,2.3 v49.6,2.4 | v49.6,5.7 49.75,5.55 R11.2
  Bottom 0.254: v49.6,5.7 v49.6,2.4
N$13
  Top 0.254: R13.2 53.15,3.8 52.65,3.3 49.4,3.3 47.76,1.66 22.1,1.66 21.09,2.67 UC1.17
N$15
  Top 0.254: R24.2 74.21,15.49 72.99,15.49 72.03,14.53 IC7.7 IC7.6 71.4,11.26 71.4,10.3 70.38,9.28 66,9.28 65.42,8.7 63.9,8.7 63.4,9.2 63.4,12.26 C22.2
N$19  (via drill 0.4)
  Top 0.254: UC1.21 23.09,5.8 22.5,6.39 v22.5,8.7 | 11.14,14.04 R3.2 11.03,14.4 v9.86,14.4
  Bottom 0.254: 19.19,6.29 18.7,6.29 | 18.7,6.29 11.81,6.29 8.82,9.28 8.82,13.32 9.86,14.36 v9.86,14.4 | 18.7,6.29 20,6.29 21.05,7.34 | 21.21,7.5 21.05,7.34 | 21.05,7.34 22.41,8.7 v22.5,8.7
N$20
  Top 0.254: C23.1 68.5,10.7 69.3,11.5 R22.1 70.19,12.81 70.72,12.28 IC7.5
N$21
  Top 0.254: R19.1 66.03,13.33 C22.1 66.6,13.26 67.05,12.81 R22.2
N$23
  Top 0.406: POWER.9 POWER.10 88.91,18.37 D2.A
N$25
  Top 0.406: POWER.1 POWER.2 88.85,6.57 D1.C
N$42
  Top 0.254: R14.2 55.73,14.3 54.1,14.3 53.73,13.93 IC5.7 IC5.6 53.08,14.62 51.7,16 51.7,17.2 50.74,18.16 C16.2
N$43
  Top 0.254: IC5.5 52.4,13.08 51.94,13.54 C17.1 R12.1
N$45  (via drill 0.4)
  Top 0.254: R12.2 49.06,17.9 | 49.06,17.9 49.06,19.45 C16.1 | R16.1 58.26,11.74 v58.3,11.7 | v50,17.9 49.06,17.9
  Bottom 0.254: v58.3,11.7 58.3,16.1 56.5,17.9 v50,17.9
OUT1
  Top 0.254: R20.1 62.05,18.39 J5.4
OUT2
  Top 0.254: R18.1 59.62,13.52 J5.3
POT_1  (via drill 0.4)
  Top 0.254: v8.63,2.84 8.09,2.3 IC1.6 4.8,2.3 v4.7,2.4 4.35,2.75 R1.2 C1.1
  Bottom 0.254: J2.5 32.4,18.38 32.4,9.55 27.02,4.17 26.21,4.17 25.62,3.59 20.22,3.59 19.8,4 13.99,4 12.8,2.8 12.79,2.8 12.73,2.74 8.73,2.74 v8.63,2.84 | EXPANDER.1 3.03,4.07 v4.7,2.4
POT_1_MCU
  Top 0.254: C1.2 R1.1 4.35,1.05 4.95,1.65 IC1.7 9.05,1.65 10.09,0.61 17.5,0.61 18.2,1.31 18.2,3.08 UC1.13 19.09,3.69
POT_2  (via drill 0.4)
  Top 0.254: IC1.9 12.1,2.3 | IC1.9 10.6,2.3 v9.3,3.6 | IC1.9 12.35,2.3 R4.2 14,3.25 C7.1
  Bottom 0.254: J2.4 31.94,16.3 31.94,9.74 26.84,4.63 25.98,4.63 25.39,4.04 20.41,4.04 20,4.46 13.8,4.46 12.54,3.2 9.7,3.2 v9.3,3.6 9,3.9 9,5.7 6.64,8.06 EXPANDER.2
POT_2_MCU
  Top 0.254: UC1.12 17.05,4.93 C7.2 16.25,1.09 14.23,1.09 13.78,1.55 R4.1 13.2,1.65 IC1.8
POT_3  (via drill 0.4)
  Top 0.254: v7.03,5.18 7.24,5.39 9.51,5.39 v10,4.9 IC1.13 13.25,4.9 R5.2 14.1,4.85 C6.1
  Bottom 0.254: J2.3 29.9,15.9 31.49,14.31 31.49,9.93 26.65,5.09 25.79,5.09 25.2,4.5 20.6,4.5 20.18,4.92 10.02,4.92 v10,4.9 | EXPANDER.3 4.3,9.33 4.3,6.5 5.62,5.18 v7.03,5.18
POT_3_MCU
  Top 0.254: UC1.11 16.72,5.97 16.1,5.35 15.4,5.35 | C6.2 15.4,5.35 | IC1.14 12.62,6.55 R5.1 14.2,6.55 15.4,5.35
POT_4  (via drill 0.4)
  Top 0.254: IC1.2 v4.7,4.9 3.55,4.9 R2.2 C2.1 0.51,5.74 0.51,7.81 2,9.3 4.27,9.3 EXPANDER.4 | v44.1,12.8 44.66,13.36 J4.2
  Bottom 0.254: v4.7,4.9 4.7,4 6.54,2.16 12.91,2.16 14.3,3.54 19.62,3.54 20.03,3.13 25.82,3.13 26.4,3.72 38.22,3.72 39.25,4.75 41.15,4.75 42.3,5.9 42.3,11 v44.1,12.8
POT_4_MCU
  Top 0.254: C2.2 R2.1 4.75,6.35 5.55,5.55 IC1.1 6.1,5.87 10.67,5.87 12.24,7.44 14.07,7.44 15.04,6.47 UC1.10
RESET  (via drill 0.4)
  Top 0.254: v20.98,8.8 20.78,9 19.7,9 18.67,7.97 UC1.7
  Top 0.305: R7.1 24.56,21.24 v26.15,19.65
  Bottom 0.254: v20.98,8.8 21,8.82 21,9.08 24.29,12.37 JTAG.10 25.05,15.75 26.15,16.85 v26.15,19.65 24.2,19.65 RESET.2
SW_DUAL  (via drill 0.4)
  Top 0.254: UC1.3 18.7,9.97 19.17,9.5 23.1,9.5 v23.35,9.25
  Bottom 0.254: v23.35,9.25 27.46,13.36 J2.2
SW_MODE
  Top 0.254: J1.2 15.24,13.36 16.57,12.03 16.57,10.97 17.07,10.47 UC1.2
SW_TRIG_1  (via drill 0.4)
  Top 0.254: v37.2,4.8 36.26,3.86 35.14,3.86 34.7,4.3 34.7,5.9 32.5,8.1 31.03,8.1 30.4,7.47 UC1.29
  Bottom 0.254: J4.5 46.03,20.98 45.28,20.22 44.4,20.22 37.2,13.02 v37.2,4.8
SW_TRIG_2  (via drill 0.4)
  Top 0.254: v27.2,21.59 28.99,19.8 31.1,19.8 v31.7,20.4 | v44.3,21.3 44.3,20.6 45.2,19.7 47.02,19.7 47.7,19.02 v47.8,19.12 | UC1.40 23.09,13.5 22.1,14.49 v19.33,14.49
  Bottom 0.254: v19.33,14.49 19.01,14.49 18.1,15.4 18.1,17.6 18.6,18.1 21.2,18.1 22.6,19.5 22.6,21.1 23.1,21.6 v27.19,21.6 v27.2,21.59 | v47.8,19.12 47.88,19.2 58.5,19.2 60.6,17.1 60.6,14.7 61.94,13.36 J5.2 | v44.3,21.3 32.6,21.3 v31.7,20.4
TRIG_1  (via drill 0.4)
  Top 0.254: UC1.22 23.59,7.39 v24.5,8.3
  Bottom 0.254: J1.5 14.77,20.98 7.91,14.12 7.91,8.7 11.23,5.37 20.49,5.37 21.7,6.59 22.79,6.59 v24.5,8.3
TRIG_2  (via drill 0.4)
  Top 0.254: v23.4,8.2 24.67,9.47 UC1.33
  Bottom 0.254: J1.4 12.88,18.44 8.37,13.93 8.37,9.09 11.62,5.83 20.19,5.83 21.4,7.04 22.24,7.04 v23.4,8.2
VCC  (via drill 0.4)
  Top 0.254: C27.1 73.61,11.28 IC7.8 | IC5.8 C20.1 54.6,10.7 54.6,7.6
  Top 0.406: D2.C v81.8,20.3 79.74,20.3 C28.+ | IC3.3 43.3,14.42 43.3,12.2 44.4,11.1 44.4,9.8 44.8,9.4 52,9.4 53.8,7.6 54.6,7.6 v63.3,7.6 65.2,7.6 66.35,8.75 74.4,8.75 | 74.4,8.75 76.45,8.75 76.9,8.3 81.4,8.3 v81.8,8.7 | C27.1 74.41,8.76 74.4,8.75
  Bottom 0.406: v81.8,20.3 v81.8,8.7 | v63.3,7.6 63.3,3.2 61.3,1.2 19.7,1.2 19.3,1.6 3.1,1.6 1.5,3.2 1.5,14.15 EXPANDER.7 EXPANDER.8
VEE  (via drill 0.4)
  Top 0.254: v52.5,16.9 52.42,16.98 IC5.4 52.42,21.07 C19.2 | IC7.4 70.72,15.62 70.28,15.18 C24.2 | v54.7,2 54.72,1.98
  Top 0.406: D1.A 79.92,2.51 C29.- 78.61,1.2 69.66,1.2 v68.88,1.98 | R21.1 67.96,2.9 v68.88,1.98 | v69.3,14 C24.2 | 54.72,1.98 v68.88,1.98 | v54.7,2 53.28,0.58 19,0.58 v18.8,0.78
  Bottom 0.406: v69.3,14 69.28,13.98 69.28,10.2 67.1,8.02 67.1,2.8 67.92,1.98 v68.88,1.98 | v54.7,2 54.7,14.7 v52.5,16.9 | v18.8,0.78 18.6,0.58 2.22,0.58 0.58,2.22 0.58,15.77 EXPANDER.9 EXPANDER.10

### Text on the board
bPlace: RED | Do not connect to power | Apex By: / Shay Shezifi (PLUM) | MAIN BOARD | v1.0 | Apex | Based on Peaks By: / Émilie Gillet | CC-BY-SA 4.0 | file: ApexIJ_1_0.brd